# Altium schematic sheet RP5_Left_Board.SchDoc
size A3; SheetNumber: 1; SheetTotal: 1
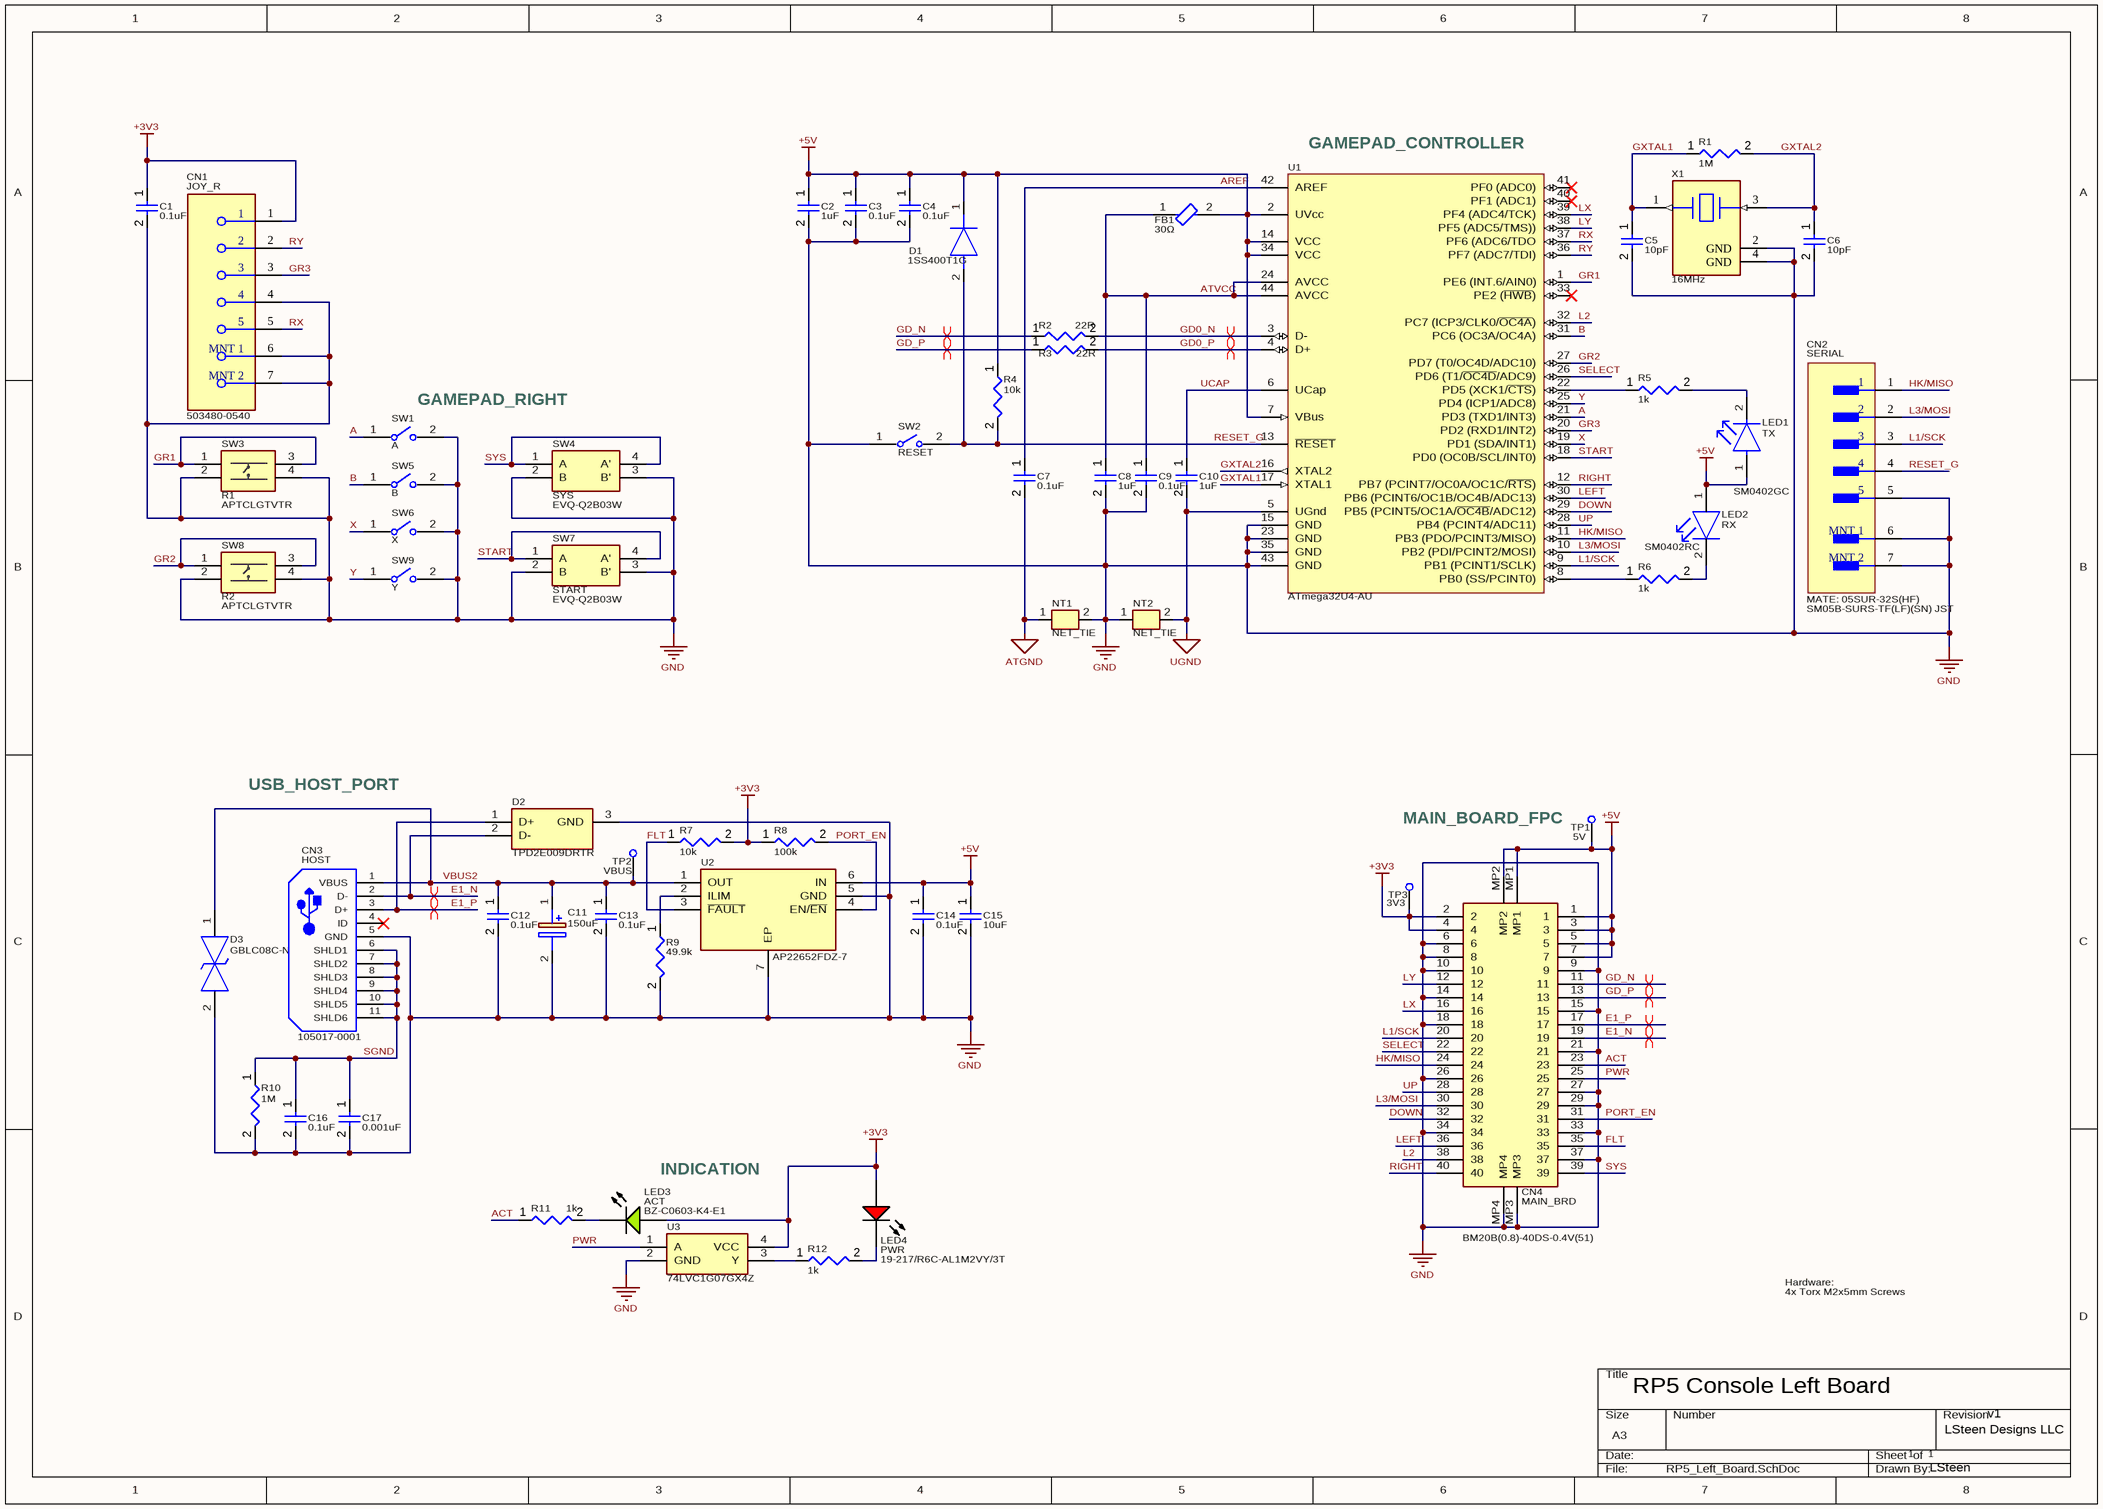
[diagram p0: RP5_Left_Board.SchDoc]

## Parts
C1  0.1uF  [CAPC1005X56X25LL10T15]
C2  1uF  [CAPC0603(1608)100_L]
C3  0.1uF  [CAPC1005X56X25LL10T15]
C4  0.1uF  [CAPC1005X56X25LL10T15]
C5  10pF  [CAPC1005X56X25LL10T15]
C6  10pF  [CAPC1005X56X25LL10T15]
C7  0.1uF  [CAPC1005X56X25LL10T15]
C8  1uF  [CAPC0603(1608)100_L]
C9  0.1uF  [CAPC1005X56X25LL10T15]
C10  1uF  [CAPC0603(1608)100_L]
C11  150uF  [CAPPM7344X310N]
C12  0.1uF  [CAPC1005X56X25LL10T15]
C13  0.1uF  [CAPC1005X56X25LL10T15]
C14  0.1uF  [CAPC1005X56X25LL10T15]
C15  10uF  [CAPC0805(2012)145_L]
C16  0.1uF  [CAPC1005X56X25LL10T15]
C17  0.001uF  [CAPC1005X56X25LL10T15]
CN1  JOY_R  [FP-503480-0540-MFG]
CN2  SERIAL  [FP-SM05B-SURS-TF_LF_SN-MFG]
CN3  HOST  [105017-0001]
CN4  MAIN_BRD  [BM20B0840DS04V51]
D1  1SS400T1G  [SODFL1608X70N]
D2  TPD2E009DRTR  [SOTFL35P100X50-3N]
D3  GBLC08C-N  [SOD-323_L1.8-W1.3-LS2.5-BI]
FB1  30Ω  [FP-MH2029-MFG]
LED1  TX  [FP-SM0402GC-MFG]
LED2  RX  [FP-SM0402RC-MFG]
LED3  ACT  [LED_0603]
LED4  PWR  [EVRL-0603-2_V]
NT1  NET_TIE  [NET_TIE1]  (net tie, no BOM)
NT2  NET_TIE  [NET_TIE1]  (net tie, no BOM)
R1  1M  [RESC0402(1005)_L]
R2  22R  [RESC0402(1005)_L]
R3  22R  [RESC0402(1005)_L]
R4  10k  [RESC0402(1005)_L]
R5  1k  [RESC0402(1005)_L]
R6  1k  [RESC0402(1005)_L]
R7  10k  [RESC0402(1005)_L]
R8  100k  [RESC0402(1005)_L]
R9  49.9k  [RESC0402(1005)_L]
R10  1M  [RESC0402(1005)_L]
R11  1k  [RESC0402(1005)_L]
R12  1k  [RESC0402(1005)_L]
SW1  A  [L4.0-W4.0-CNDV-PAD]
SW2  RESET  [FP-B3U-1000P-MFG]
SW3  R1  [APTCLGTVTR]
SW4  SYS  [EVQQ2]
SW5  B  [L4.0-W4.0-CNDV-PAD]
SW6  X  [L4.0-W4.0-CNDV-PAD]
SW7  START  [EVQQ2]
SW8  R2  [APTCLGTVTR_No_Holes]
SW9  Y  [L4.0-W4.0-CNDV-PAD]
TP1  5V  [TP]  (no BOM)
TP2  VBUS  [TP]  (no BOM)
TP3  3V3  [TP]  (no BOM)
U1  ATmega32U4-AU  [44ML_M]
U2  AP22652FDZ-7  [SON65P200X200X80-7N-D]
U3  74LVC1G07GX4Z  [74LVC1G07GX4Z]
X1  16MHz  [FP-ABM8G-MFG]

## Nets
+3V3: C1.1 CN1.1 CN4.2 CN4.4 LED3.1(A) LED4.1(A) R7.2 R8.1 TP3.1 U3.4(VCC)
+5V: C2.1 C3.1 C4.1 C14.1 C15.1 CN4.1 CN4.3 CN4.5 CN4.7 CN4.MP1 CN4.MP2 D1.1(K) FB1.2 LED1.1(A) LED2.1(A) R4.1 TP1.1 U1.2(UVcc) U1.7(VBus) U1.14(VCC) U1.34(VCC) U2.6(IN)
ATGND: C7.2 NT1.1
GND: C1.2 C2.2 C3.2 C4.2 C5.2 C6.2 C8.2 C9.2 C11.2(-) C12.2 C13.2 C14.2 C15.2 C16.2 C17.2 CN1.4 CN1.6(MNT_1) CN1.7(MNT_2) CN2.5 CN2.6(MNT_1) CN2.7(MNT_2) CN3.5(GND) CN4.6 CN4.8 CN4.9 CN4.10 CN4.14 CN4.15 CN4.18 CN4.21 CN4.26 CN4.27 CN4.29 CN4.33 CN4.34 CN4.37 CN4.MP3 CN4.MP4 D2.3(GND) D3.2 NT1.2 NT2.1 R9.2 R10.2 SW1.2 SW2.1 SW3.2 SW3.4 SW4.2(B) SW4.3(B') SW5.2 SW6.2 SW7.2(B) SW7.3(B') SW8.2 SW8.4 SW9.2 U1.15(GND) U1.23(GND) U1.35(GND) U1.43(GND) U2.5(GND) U2.7(EP) U3.2(GND) X1.2(GND) X1.4(GND)
UGND: C10.2 NT2.2 U1.5(UGnd)
A: SW1.1 U1.21(PD3_(TXD1/INT3))
ACT: CN4.23 R11.1
AREF: C7.1 U1.42(AREF)
ATVCC: C8.1 C9.1 FB1.1 U1.24(AVCC) U1.44(AVCC)
B: SW5.1 U1.31(PC6_(OC3A/OC4A))
DOWN: CN4.32 U1.29(PB5_(PCINT5/OC1A/~{OC4B}/ADC12))
E1_N: CN3.2(D-) CN4.19 D2.2(D-)
E1_P: CN3.3(D+) CN4.17 D2.1(D+)
FLT: CN4.35 R7.1 U2.3(~{FAULT})
GD0_N: R2.2 U1.3(D-)
GD0_P: R3.2 U1.4(D+)
GD_N: CN4.11 R2.1
GD_P: CN4.13 R3.1
GR1: SW3.1 SW3.3 U1.1(PE6_(INT.6/AIN0))
GR2: SW8.1 SW8.3 U1.27(PD7_(T0/OC4D/ADC10))
GR3: CN1.3 U1.20(PD2_(RXD1/INT2))
GXTAL1: C5.1 R1.1 U1.17(XTAL1) X1.1
GXTAL2: C6.1 R1.2 U1.16(XTAL2) X1.3
HK/MISO: CN2.1 CN4.24 U1.11(PB3_(PDO/PCINT3/MISO))
L1/SCK: CN2.3 CN4.20 U1.9(PB1_(PCINT1/SCLK))
L2: CN4.38 U1.32(PC7_(ICP3/CLK0/~{OC4A}))
L3/MOSI: CN2.2 CN4.30 U1.10(PB2_(PDI/PCINT2/MOSI))
LEFT: CN4.36 U1.30(PB6_(PCINT6/OC1B/OC4B/ADC13))
LX: CN4.16 U1.39(PF4_(ADC4/TCK))
LY: CN4.12 U1.38(PF5_(ADC5/TMS)))
PORT_EN: CN4.31 R8.2 U2.4(EN/~{EN})
PWR: CN4.25 U3.1(A)
RESET_G: CN2.4 D1.2(A) R4.2 SW2.2 U1.13(~{RESET})
RIGHT: CN4.40 U1.12(PB7_(PCINT7/OC0A/OC1C/~{RTS}))
RX: CN1.5 U1.37(PF6_(ADC6/TDO)
RY: CN1.2 U1.36(PF7_(ADC7/TDI))
SELECT: CN4.22 U1.26(PD6_(T1/~{OC4D}/ADC9))
SGND: C16.1 C17.1 CN3.6(SHLD1) CN3.7(SHLD2) CN3.8(SHLD3) CN3.9(SHLD4) CN3.10(SHLD5) CN3.11(SHLD6) R10.1
START: SW7.1(A) SW7.4(A') U1.18(PD0_(OC0B/SCL/INT0))
SYS: CN4.39 SW4.1(A) SW4.4(A')
UCAP: C10.1 U1.6(UCap)
UP: CN4.28 U1.28(PB4_(PCINT4/ADC11))
VBUS2: C11.1(+) C12.1 C13.1 CN3.1(VBUS) D3.1 TP2.1 U2.1(OUT)
X: SW6.1 U1.19(PD1_(SDA/INT1))
Y: SW9.1 U1.25(PD4_(ICP1/ADC8))
NetLED1_2: LED1.2(C) R5.2
NetLED2_2: LED2.2(C) R6.2
NetLED3_2: LED3.2(K) R11.2
NetLED4_2: LED4.2(K) R12.2
NetR5_1: R5.1 U1.22(PD5_(XCK1/~{CTS}))
NetR6_1: R6.1 U1.8(PB0_(SS/PCINT0))
NetR9_1: R9.1 U2.2(ILIM)
NetR12_1: R12.1 U3.3(Y)

Not connected (* = marked no-connect by the designer): CN3 4(ID)*; U1 33(PE2_(~{HWB}))* 40(PF1_(ADC1))* 41(PF0_(ADC0))*

## Layout directives
differential pair; differential pair class USB 2.0: E1_N, E1_P, GD0_N, GD0_P, GD_N, GD_P

## Notes on the sheet
- (near U1) GAMEPAD_CONTROLLER
- 503480-0540
- (near SW1) GAMEPAD_RIGHT
- (near SW3) APTCLGTVTR
- (near SW4) EVQ-Q2B03W
- SM0402GC
- SM0402RC
- (near SW8) APTCLGTVTR
- (near SW7) EVQ-Q2B03W
- (near CN2) MATE: 05SUR-32S(HF)
- (near CN2) SM05B-SURS-TF(LF)(SN) JST
- USB_HOST_PORT
- MAIN_BOARD_FPC
- (near CN3) 105017-0001
- INDICATION
- (near LED3) BZ-C0603-K4-E1
- 19-217/R6C-AL1M2VY/3T
- (near CN4) BM20B(0.8)-40DS-0.4V(51)
- Hardware:
- 4x Torx M2x5mm Screws
- RP5 Console Left Board
- 1
- LSteen Designs LLC
- v1
- LSteen

## Library data of the parts
C1 C3 C4 C7 C9 C12-C14 C16 = CMP-001-00001-6: Chip Capacitor, 0.1 uF, +/- 5%, 16 V, 0402 (1005 Metric); Capacitor Type: Ceramic; Voltage Rating: 16V; Max Operating Temperature: 125°C; Min Operating Temperature: -55°C; Case/Package: 0402; Value: 0.1uF; Mounting Technology: SM; Pins: 2; Tolerance: 5%; RoHS Compliant: True
C2 C8 C10 = CMP-001-00076-4: Chip Capacitor, 1uF +/-20%, 10V, 0603, Thickness 1 mm; Tolerance: 10%; Mounting Technology: SMT; Case/Package: 0603; Pins: 2; Min Operating Temperature: -55°C; Max Operating Temperature: 85°C; Value: 1uF; Voltage Rating: 10V
C5 C6 = CMP-001-00001-6: Chip Capacitor, 10 pF, +/- 5%, 16 V, 0402 (1005 Metric); Capacitor Type: Ceramic; Voltage Rating: 16V; Max Operating Temperature: 125°C; Min Operating Temperature: -55°C; Case/Package: 0402; Value: 10pF; Mounting Technology: SM; Pins: 2; Tolerance: 5%; RoHS Compliant: True
C11 = TPSD157K016S0125: Capacitor Polarised; Manufacturer_Name: AVX; Datasheet Link: http://datasheets.avx.com/TAJ.pdf; Height: 3.1mm; Manufacturer_Part_Number: TPSD157K016S0125; Mouser Part Number: 581-TPSD157K016S0125; Mouser Price/Stock: https://www.mouser.co.uk/ProductDetail/AVX/TAJD157K016RNJV?qs=%252BZP6%2F%252BtExtCxiQ2tCar1OQ%3D%3D; Arrow Part Number: TPSD157K016S0125; Arrow Price/Stock: https://www.arrow.com/en/products/tajd157k016rnjv/avx; Supplier 1: Mouser; Supplier Part Number 1: 581-TPSD157K016S0125
C15 = CMP-001-00079-4: Chip Capacitor, 10µF +/-20%, 25V, 0805, Thickness 1.45 mm; Tolerance: 10%; Max Operating Temperature: 85°C; Value: 10µF; Case/Package: 0805; Voltage Rating: 25V; Min Operating Temperature: -55°C; Mounting Technology: SMT; Pins: 2
C17 = CMP-001-00001-6: Chip Capacitor, 0.1 uF, +/- 5%, 16 V, 0402 (1005 Metric); Capacitor Type: Ceramic; Value: 0.1uF; Voltage Rating: 16V; Max Operating Temperature: 125°C; Min Operating Temperature: -55°C; Case/Package: 0402; Mounting Technology: SM; Pins: 2; Tolerance: 5%; RoHS Compliant: True
CN1 = CMP-00257-52963780-1: 503480-0540 Connector FFC/FPC SKT 5 Position 0.5mm Solder Right Angle Surface Mount T/R; Manufacturer Lifecycle Status: ACTIVE; Actuator Material: Glass, Nylon, Polyamide; Number of Positions: 5; Pitch: 508µm; Plating: Gold; Voltage Rating: 50V; Current Rating: 500mA; Wire/Cable Type: Straight; Contact Plating: Gold; Termination: Solder; Country of Origin: KR; Number of Rows: 1; RoHS: Compliant; NexarPartId: 52963780; Max Operating Temperature: 85°C; Lifecycle Status: Production; Mount: Surface Mount; Halogen Free: Low Halogen; Height: 2.07mm; Housing Material: Polymer; Number of Circuits: 5; Number of Contacts: 5; Min Operating Temperature: -40°C; Flammability Rating: UL94 V-0; Contact Material: Bronze, Gold, Nickel; Orientation: Right Angle
CN2 = CMP-17439-000553-2: CONN HEADER SMD R/A 5POS 0.8MM; Pitch: 800µm; Voltage Rating: 30V; Number of Poles: 5; Current Rating: 500mA; Max Operating Temperature: 85°C; Case/Package: SMD/SMT; Width: 2.7mm; Min Operating Temperature: -25°C; Lead Free: Lead Free; Height: 1.75mm; Contact Material: Copper, Tin; Length: 6.2mm; Number of Rows: 1; Number of Contacts: 5; RoHS: Compliant
CN3 = 105017-0001: Micro USB Connector; Manufacturer_Name: Molex; Manufacturer_Part_Number: 105017-0001; Mouser Part Number: 538-105017-0001; Supplier 1: Mouser; Supplier 2: Digikey; Supplier Part Number 1: 538-105017-0001; Supplier Part Number 2: WM1399CT-ND
CN4 = BM20B(0.8)-40DS-0.4V(51): Connector; Manufacturer_Name: Hirose; Datasheet Link: https://datasheet.datasheetarchive.com/originals/distributors/Datasheets-DGA17/1065509.pdf; Height: 0.9mm; Manufacturer_Part_Number: BM20B(0.8)-40DS-0.4V(51); Mouser Part Number: 798-BM20B0840DS04V51; Mouser Price/Stock: https://www.mouser.co.uk/ProductDetail/Hirose-Connector/BM20B0.8-40DS-0.4V51?qs=AAveGqk956F9p8KJryTUVg%3D%3D; Supplier 1: Mouser; Supplier Part Number 1: 798-BM20B0840DS04V51; System: Connector
D1 = 1SS400T1G: Diode; Manufacturer_Name: onsemi; Datasheet Link: http://www.onsemi.com/pub/Collateral/1SS400T1-D.PDF; Height: 0.7mm; Manufacturer_Part_Number: 1SS400T1G; Mouser Part Number: 863-1SS400T1G; Mouser Price/Stock: https://www.mouser.co.uk/ProductDetail/onsemi/1SS400T1G?qs=vLkC5FC1VN8%2F6DEK%2F5shrw%3D%3D; Arrow Part Number: 1SS400T1G; Arrow Price/Stock: https://www.arrow.com/en/products/1ss400t1g/on-semiconductor?region=nac; Supplier 1: Mouser; Supplier Part Number 1: 863-1SS400T1G
D2 = TPD2E009DRTR: Integrated Circuit; Manufacturer_Name: Texas Instruments; Datasheet Link: https://www.ti.com/lit/ds/symlink/tpd2e009.pdf?ts=1621336941637&ref_url=https%253A%252F%252Fwww.google.com%252F; Height: 0.5mm; Manufacturer_Part_Number: TPD2E009DRTR; Mouser Part Number: 595-TPD2E009DRTR; Mouser Price/Stock: https://www.mouser.co.uk/ProductDetail/Texas-Instruments/TPD2E009DRTR?qs=XGzIaZb%2FFYLhG8oL%2FM05Rg%3D%3D; Arrow Part Number: TPD2E009DRTR; Arrow Price/Stock: https://www.arrow.com/en/products/tpd2e009drtr/texas-instruments?region=nac; Supplier 1: Mouser; Supplier Part Number 1: 595-TPD2E009DRTR
D3 = GBLC08C-N: ESD DIODE-BI_LCSC#C314256
FB1 = CMP-07252-000001-1: FERRITE BEAD 30 OHM 0805 1LN; Manufacturer Part Number: MH2029-300Y; Manufacturer: Bourns; Series Resistance: 25mΩ; Impedance At Frequency: 30Ω @ 100MHz; Rms Current: 3A; Tolerance: 25%; RoHS: TRUE; Temperature Range High: +125°C; Device Class L3: Ferrite Beads and Chips; Core Material: Ferrite; ComponentLink2Description: Datasheet; Category: FBead; Octopart: https://octopart.com/mh2029-300y-bourns-756929; Digikey Description: FERRITE BEAD 30 OHM 0805 1LN; Device Class L2: EMI / RFI Components; Resistance: 30Ω; Lead Free: Yes; Value: 30Ω; Mouser Description: Ferrite Beads 30 ohms 25% HIGH CURRENT; Automotive: No; Ipc Land Pattern Name: CAPC200120X90; Temperature: -55°C to +125°C; Device Class L1: Passive Components; Height: 1.1mm; ComponentLink2URL: https://www.bourns.com/docs/Product-Datasheets/mh.pdf; Package: MH2029; Temperature Range Low: -55°C
LED1 = CMP-35283-000001-2: LED GREEN CLEAR 0402 SMD SUPPLIMENT LCSC MHT136CGCT; Lens Size: 1mm; Luminous Intensity: 28.5mcd; Viewing Angle: 130°; Forward Voltage: 1.9V; Test Current: 20mA; Lens Color: Colorless; Lens Style: Flat; Dominant Wavelength: 572nm; Case Code (Metric): 1005; Mount: Surface Mount; Case Code (Imperial): 0402; Length: 1mm; Width: 0.5mm; Case/Package: 0402; Lens Transparency: Clear; Height: 0.71mm; Packaging: Tape and Reel; Color: Green
LED2 = CMP-35283-000003-1: LED RED CLEAR 0402 SMD SUPPLIMENT LCSC MHT136CRCT; Test Current: 20mA; Luminous Intensity: 90mcd; Lens Color: Colorless; Lens Style: Flat; Lens Size: 1mm; Forward Voltage: 2.1V; Viewing Angle: 130°; Dominant Wavelength: 631nm; Width: 0.5mm; Length: 1mm; Packaging: Tape and Reel; Height: 0.71mm; Lens Transparency: Clear; Case Code (Imperial): 0402; Case/Package: 0402; Mount: Surface Mount; Case Code (Metric): 1005; Color: Red
LED3 = BZ-C0603-K4-E1: MPN: BZ-C0603-K4-E1
LED4 = CMP-2100-03578-1: Chip LED, Red, 5 V, 25 mA, -40 to 85 degC, 2-Pin SMD (0603), RoHS, Tape and Reel; Manufacturer: Everlight Electronics; Manufacturer Part Number: 19-217/R6C-AL1M2VY/3T; Forward Voltage: 2.2V; Lens Style: Clear; Shape: Rectangular; Forward Current: 25mA; Luminous Intensity-Nom: 20mcd; Channels: 1; Optoelectronic Device Type: SINGLE COLOR LED; Viewing Angle: 120°; Overall Height: 0.4mm; Package Reference: 0603; Case/Package: 0603; RoHSCompliant: false; Package Description: 2-Pin Surface Mount Device, Body 1.6 x 0.8 mm; Colour: Red; Lead Free: LeadFree; Datasheet URL: https://datasheet.ciiva.com/4688/el-19-217-r6c-al1m2vy-3tpdf-187026-4688713.pdf; Manufacturer URL: http://www.everlight.com/; Datasheet Version: Rev. 1, 01/2005; Supplier: Digikey; Supplier Part Number: 1080-1585-6-ND; RoHS: Yes; Category: LEDs; Mounting Technology: Surface Mount; Pins: 2; Color: Red; Min Operating Temperature: -40°C; Max Operating Temperature: 85°C; Packaging: Tape and Reel; Size: 1mm; Terminal Pitch: 1.5mm; Reach SVHC Compliant: Yes; RoHS Compliant: Yes; ComponentLink1URL: https://datasheet.ciiva.com:443/pdfs/VipMasterIC/IC/EVER/EVER-S-A0007433843/EVER-S-A0007433843-1.pdf?src-supplier=IHS+Markit; ComponentLink1Description: https://datasheet.ciiva.com:443/pdfs/VipMasterIC/IC/EVER/EVER-S-A0007433843/EVER-S-A0007433843-1.pdf?src-supplier=IHS+Markit; ComponentLink2URL: https://media.digikey.com/pdf/Data%20Sheets/Everlight%20PDFs/19-217-R6C-AL1M2VY-3T.pdf?src-supplier=Digikey; ComponentLink2Description: https://media.digikey.com/pdf/Data%20Sheets/Everlight%20PDFs/19-217-R6C-AL1M2VY-3T.pdf?src-supplier=Digikey
R1 R10 = CMP-009-00138-3: Chip Resistor, 1 MOhms, +/-5 %, 63 mW, -55 to 155 degC, 0402; Tolerance: 5%; Power: 63mW; Max Operating Temperature: 155°C; Pins: 2; Value: 1M; Min Operating Temperature: -55°C; Case/Package: 0402
R2 R3 = CMP-009-00138-3: Chip Resistor, 22 Ohms, +/-5 %, 63 mW, -55 to 155 degC, 0402; Tolerance: 5%; Power: 63mW; Max Operating Temperature: 155°C; Pins: 2; Value: 22R; Min Operating Temperature: -55°C; Case/Package: 0402
R4 R7 = CMP-009-00138-3: Chip Resistor, 10 kOhms, +/-5 %, 63 mW, -55 to 155 degC, 0402; Tolerance: 5%; Power: 63mW; Max Operating Temperature: 155°C; Pins: 2; Value: 10k; Min Operating Temperature: -55°C; Case/Package: 0402
R5 R6 R11 R12 = CMP-009-00138-3: Chip Resistor, 1 kOhms, +/-5 %, 63 mW, -55 to 155 degC, 0402; Tolerance: 5%; Power: 63mW; Max Operating Temperature: 155°C; Pins: 2; Value: 1k; Min Operating Temperature: -55°C; Case/Package: 0402
R8 = CMP-009-00138-3: Chip Resistor, 100 kOhms, +/-5 %, 63 mW, -55 to 155 degC, 0402; Tolerance: 5%; Power: 63mW; Max Operating Temperature: 155°C; Pins: 2; Value: 100k; Min Operating Temperature: -55°C; Case/Package: 0402
R9 = CMP-009-00138-3: Chip Resistor, 49.9 kOhms, +/-5 %, 63 mW, -55 to 155 degC, 0402; Tolerance: 5%; Power: 63mW; Max Operating Temperature: 155°C; Pins: 2; Value: 49.9k; Min Operating Temperature: -55°C; Case/Package: 0402
SW1 SW5 SW6 SW9 = CNDV_SW: Conductive Pad Switch
SW2 = CMP-2100-03586-2: LCSC SWITCH TACTILE SPST-NO 0.05A 12V; Contact Resistance: 100mR; Operating Force: 1.5N; Max Current Rating: 50mA; Switch Travel: 0.15mm; Actuator Type: Standard; Mechanical Life: 200000Cycles; Ratings: Dust Proof; Illumination Type: Non-Illuminated; Throw Configuration: SPST; Actuator Length: 0.4mm; Switch Function: Off-Mom; Height: 1.2mm; Width: 3mm; Weight: 0.000776oz; Contact Material: Silver; Max Voltage Rating (DC): 12V; Insulation Resistance: 100MR; Lead Free: Lead Free; Current Rating: 50mA; Termination: SMD/SMT; Length: 4mm; Voltage Rating (DC): 12V; Contact Current Rating: 50mA; Orientation: Straight; Depth: 2.5mm; Max Operating Temperature: 70°C; Packaging: Tape and Reel; Min Operating Temperature: -25°C; Package Quantity: 1; Mount: Surface Mount; Electrical Life: 200000Cycles
SW3 = APTCLGTVTR: Switch; Manufacturer_Name: Apem; Datasheet Link: https://media.digikey.com/pdf/Data%20Sheets/APEM%20Components%20PDFs/APTCLGTV.pdf; Height: 1.87mm; Manufacturer_Part_Number: APTCLGTVTR; Mouser Part Number: 642-APTCLGTVTR; Mouser Price/Stock: https://www.mouser.co.uk/ProductDetail/Apem/APTCLGTVTR?qs=ikKlZSMjbcRNf%252Bwzp31ctg%3D%3D
SW4 SW7 = EVQ-Q2B03W: Switch; Manufacturer_Name: Panasonic; Datasheet Link: https://industrial.panasonic.com/cdbs/www-data/pdf/ATK0000/ATK0000C360.pdf; Manufacturer_Part_Number: EVQ-Q2B03W; Mouser Part Number: 667-EVQ-Q2B03W; Mouser Price/Stock: https://www.mouser.co.uk/ProductDetail/Panasonic/EVQ-Q2B03W?qs=WwqriLBepZtuDDVMSV2X%252BA%3D%3D; Arrow Part Number: EVQ-Q2B03W; Arrow Price/Stock: https://www.arrow.com/en/products/evq-q2b03w/panasonic; Supplier 1: Mouser; Supplier Part Number 1: 667-EVQ-Q2B03W
SW8 = APTCLGTVTR_NH: Switch; Manufacturer_Name: Apem; Datasheet Link: https://media.digikey.com/pdf/Data%20Sheets/APEM%20Components%20PDFs/APTCLGTV.pdf; Height: 1.87mm; Manufacturer_Part_Number: APTCLGTVTR; Mouser Part Number: 642-APTCLGTVTR; Mouser Price/Stock: https://www.mouser.co.uk/ProductDetail/Apem/APTCLGTVTR?qs=ikKlZSMjbcRNf%252Bwzp31ctg%3D%3D; Supplier 1: Mouser; Supplier Part Number 1: 642-APTCLGTVTR
TP1-TP3 = TestPoint
U1 = CMP-0095-00285-2: 8-bit AVR Microcontroller, 2.7-5.5V, 16MHz, 32KB Flash, 1KB EEPROM, 2.5KB SRAM, USB Controller, 44-pin TQFP, Industrial Grade (-40°C to 85°C), Ext Osc; RevisionNote: DatasheetVersion updated. URLs added.; ComponentLink1Description: Manufacturer URL; PackageDescription: 44-Pin Plastic Thin Quad Flat Pack, 10 x 10 x 1.0 mm Body, 0.8 mm Pitch (TQFP); DatasheetVersion: revF, Nov-2010; ComponentLink2URL: http://www.atmel.com/dyn/resources/prod_documents/doc7766.pdf; ComponentLink1URL: http://www.atmel.com/; PackageReference: 44ML; ComponentLink2Description: ATmega16U4/32U4 Datasheet; PackageVersion: rev.G, Jul-2007; ComponentLink3URL: http://www.atmel.com/dyn/resources/prod_documents/7766S.pdf; ComponentLink3Description: ATmega16U4 ATmega32U4 Summary
U2 = AP22652FDZ-7: Integrated Circuit; Manufacturer_Name: Diodes Incorporated; Datasheet Link: https://www.diodes.com//assets/Datasheets/AP22652_53_52A_53A.pdf; Height: 0.8mm; Manufacturer_Part_Number: AP22652FDZ-7; Mouser Part Number: 621-AP22652FDZ-7; Mouser Price/Stock: https://www.mouser.co.uk/ProductDetail/Diodes-Incorporated/AP22652FDZ-7?qs=rkhjVJ6%2F3EKN8%2FqxLFOecw%3D%3D; Arrow Part Number: AP22652FDZ-7; Arrow Price/Stock: https://www.arrow.com/en/products/ap22652fdz-7/diodes-incorporated?region=nac; Supplier 1: Mouser; Supplier Part Number 1: 621-AP22652FDZ-7
U3 = 74LVC1G07GX4Z: Integrated Circuit; Manufacturer_Name: Nexperia; Datasheet Link: https://assets.nexperia.com/documents/data-sheet/74LVC1G07.pdf; Height: 0.35mm; Manufacturer_Part_Number: 74LVC1G07GX4Z; Mouser Part Number: 771-74LVC1G07GX4Z; Mouser Price/Stock: https://www.mouser.co.uk/ProductDetail/Nexperia/74LVC1G07GX4Z?qs=u16ybLDytRaaOC9%252BoslzEg%3D%3D; Arrow Part Number: 74LVC1G07GX4Z; Arrow Price/Stock: https://www.arrow.com/en/products/74lvc1g07gx4z/nexperia?region=nac; Supplier 1: Mouser; Supplier Part Number 1: 771-74LVC1G07GX4Z
X1 = CMP-27762-015167-1: Crystal 16MHz ±30ppm (Tol) ±30ppm (Stability) 10pF FUND 80Ω 4-Pin SMD T/R; ESR (Equivalent Series Resistance): 80R; Package Quantity: 1000; Frequency: 16MHz; Length: 3.2mm; Tolerance: 30ppm; Frequency Stability: 30ppm; Depth: 2.5mm; Termination: SMD/SMT; Number of Pins: 4; Max Operating Temperature: 70°C; Min Operating Temperature: -20°C; Mount: Surface Mount; Lead Free: Lead Free; Frequency Tolerance: 30ppm; Width: 2.5mm; Series: ABM8G; Load Capacitance: 10pF; Operating Frequency: 16 MHz; Case/Package: CSMD; Height: 1mm; Packaging: Tape and Reel